# Altium schematic sheet RFD_PWR_MGMT.SchDoc
size C; SheetNumber: 7; SheetTotal: 10
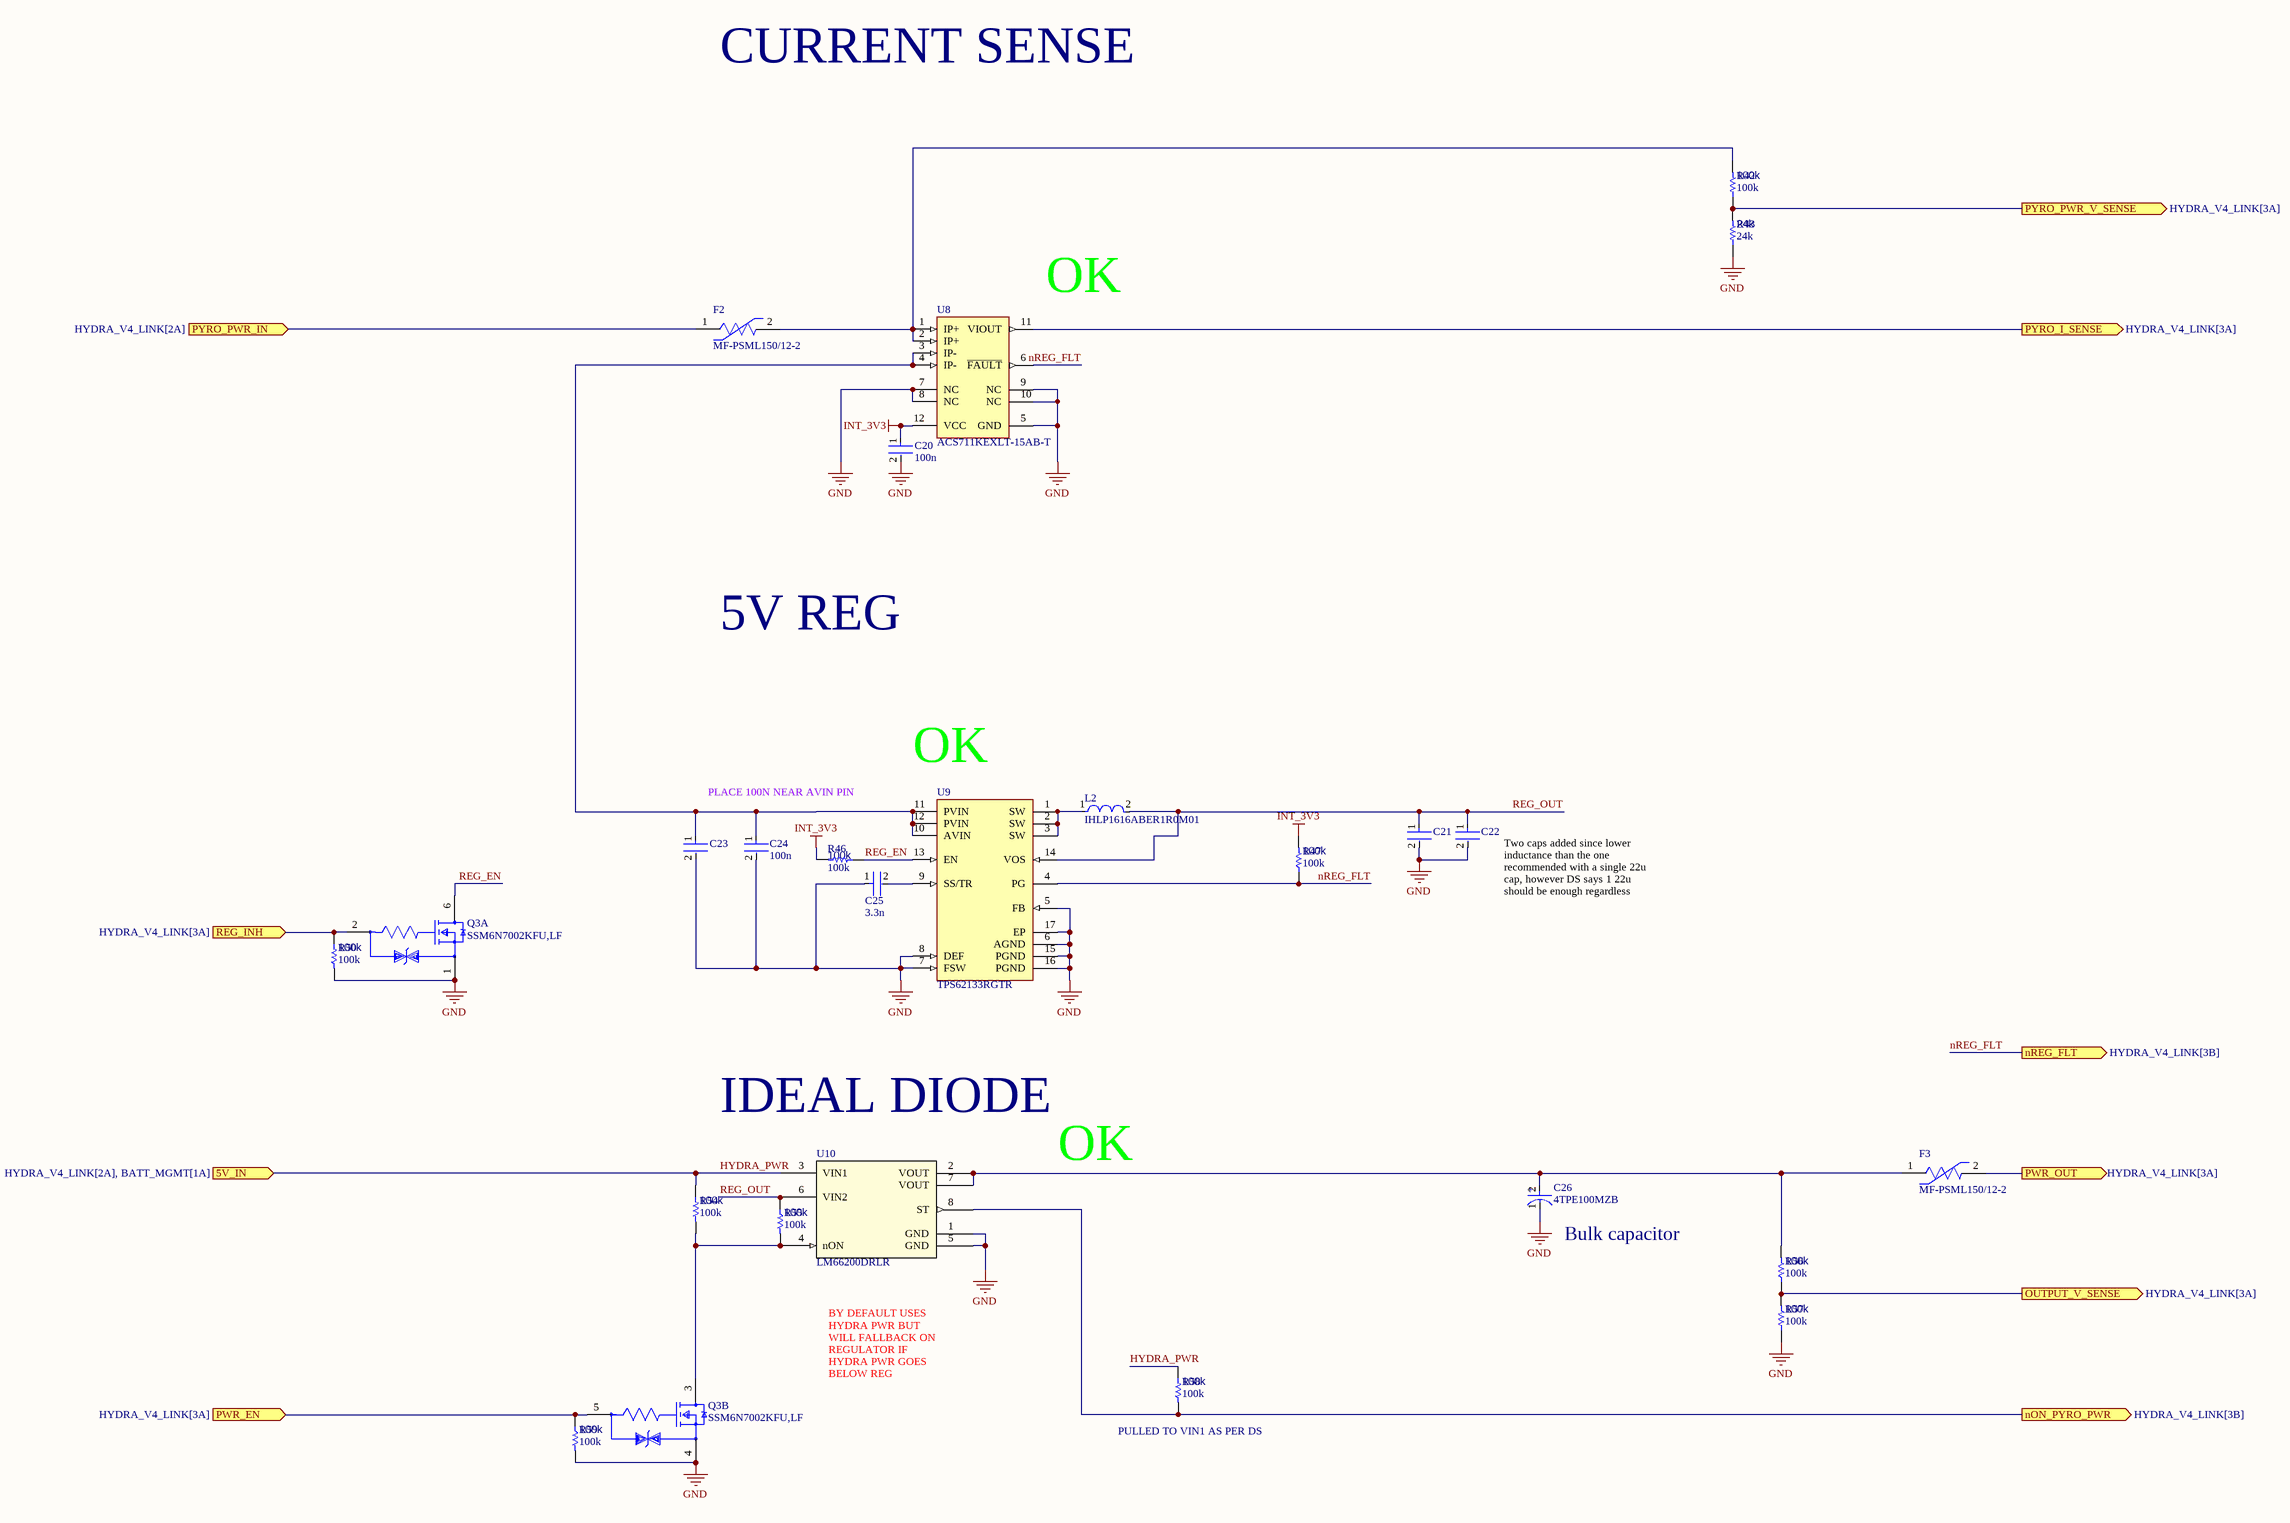
[diagram p0: RFD_PWR_MGMT.SchDoc]

## Parts
C20  100n  [FP-0402-L_1_0_0_05-W_0_5-IPC_A]
C21  GRM21BR61E226ME44L  [FP-GRM21B-0_2-e0_2_0_7-IPC_B]  (value not drawn)
C22  GRM21BR61E226ME44L  [FP-GRM21B-0_2-e0_2_0_7-IPC_B]  (value not drawn)
C23  TMK212BBJ106KG-T  [FP-0805-L_2_0_0_2-W_1_25-MFG]  (value not drawn)
C24  100n  [FP-0402-L_1_0_0_05-W_0_5-IPC_A]
C25  3.3n  [FP-0402-L_1_0_0_05-W_0_5-IPC_A]
C26  4TPE100MZB  [FP-POSCAP-B2-MFG]
F2  MF-PSML150/12-2  [FP-MF-PSMF-MFG]
F3  MF-PSML150/12-2  [FP-MF-PSMF-MFG]
L2  IHLP1616ABER1R0M01  [FP-IHLP-1616AB-FP_1_8545x-MFG]
Q3  SSM6N7002KFU,LF  [FP-SSOP6-P-0_65A-MFG]  (parts A,B of 2)
R42  100k  [R0603B]
R43  24k  [R0603B]
R46  100k  [R0603B]
R47  100k  [R0603B]
R50  100k  [R0603B]
R54  100k  [R0603B]
R55  100k  [R0603B]
R56  100k  [R0603B]
R57  100k  [R0603B]
R58  100k  [R0603B]
R59  100k  [R0603B]
U8  ACS711KEXLT-15AB-T  [ALEG-EX-12_V]
U9  TPS62133RGTR  [RGT0016C_V]
U10  LM66200DRLR  [LM66200DRLR-Footprint-1]

## Ports
5V_IN (in, see HYDRA_V4_LINK[2A], BATT_MGMT[1A]), nON_PYRO_PWR (out, see HYDRA_V4_LINK[3B]), nREG_FLT (out, see HYDRA_V4_LINK[3B]), OUTPUT_V_SENSE (out, see HYDRA_V4_LINK[3A]), PWR_EN (in, see HYDRA_V4_LINK[3A]), PWR_OUT (out, see HYDRA_V4_LINK[3A]), PYRO_I_SENSE (out, see HYDRA_V4_LINK[3A]), PYRO_PWR_IN (in, see HYDRA_V4_LINK[2A]), PYRO_PWR_V_SENSE (out, see HYDRA_V4_LINK[3A]), REG_INH (in, see HYDRA_V4_LINK[3A])

## Nets
GND: C20.2 C21.2 C22.2 C23.2 C24.2 C25.1 C26.1(C) Q3.1(Source1) Q3.4(Source2) R43.1 R50.2 R57.1 R59.2 U8.5(GND) U8.7(NC) U8.8(NC) U8.9(NC) U8.10(NC) U9.5(FB) U9.6(AGND) U9.7(FSW) U9.8(DEF) U9.15(PGND) U9.16(PGND) U9.17(EP) U10.1(GND) U10.5(GND)
INT_3V3: C20.1 R46.2 R47.2 U8.12(VCC)
HYDRA_PWR: R54.1 R58.1 U10.3(VIN1) ; port 5V_IN
nON_PYRO_PWR: R58.2 U10.8(ST) ; port nON_PYRO_PWR
nREG_FLT: R47.1 U8.6(~{FAULT}) U9.4(PG) ; port nREG_FLT
OUTPUT_V_SENSE: R56.1 R57.2 ; port OUTPUT_V_SENSE
PWR_EN: Q3.5(Gate2) R59.1 ; port PWR_EN
PWR_OUT: F3.2 ; port PWR_OUT
PYRO_I_SENSE: U8.11(VIOUT) ; port PYRO_I_SENSE
PYRO_PWR_IN: F2.1 ; port PYRO_PWR_IN
PYRO_PWR_V_SENSE: R42.1 R43.2 ; port PYRO_PWR_V_SENSE
REG_EN: Q3.6(Drain1) R46.1 U9.13(EN)
REG_INH: Q3.2(Gate1) R50.1 ; port REG_INH
REG_OUT: C21.1 C22.1 L2.2 R55.1 U9.14(VOS) U10.6(VIN2)
NetC23_1: C23.1 C24.1 U8.3(IP-) U8.4(IP-) U9.10(AVIN) U9.11(PVIN) U9.12(PVIN)
NetC25_2: C25.2 U9.9(SS/TR)
NetC26_2: C26.2(A) F3.1 R56.2 U10.2(VOUT) U10.7(VOUT)
NetF2_2: F2.2 R42.2 U8.1(IP+) U8.2(IP+)
NetL2_1: L2.1 U9.1(SW) U9.2(SW) U9.3(SW)
NetQ3_3: Q3.3(Drain2) R54.2 R55.2 U10.4(nON)

## Notes on the sheet
- CURRENT SENSE
- (near U8) OK
- 5V REG
- (near U9) OK
- PLACE 100N NEAR AVIN PIN
- (near C22) Two caps added since lower inductance than the one recommended with a single 22u cap, however DS says 1 22u should be enough regardless
- IDEAL DIODE
- OK
- (near C26) Bulk capacitor
- BY DEFAULT USES HYDRA PWR BUT WILL FALLBACK ON REGULATOR IF HYDRA PWR GOES BELOW REG
- (near R58) PULLED TO VIN1 AS PER DS
- (in symbol CMP-05428-001141-1) +

## Library data of the parts
C20 C24 C25 = CMP-001-00058-1: LARGE PADS, 0402 CAP, CHANGE COMMENT TO MATCH REAL P/N; Capacitor Type: Ceramic; Min Operating Temperature: -55°C; Mounting Technology: Surface Mount; Pins: 2; Case/Package: 0402; RoHS Compliant: Yes; Max Operating Temperature: 85°C
  C20 C24: Value: 100n
  C25: Value: 3.3n
C21 C22 = CMP-2007-03222-3: Chip Multilayer Ceramic Capacitors for General Purpose, 0805, 22uF, X5R, 15%, 20%, 25V; Case/Package: 0805; Depth: 1.25mm; Resistor Type: Ceramic; Voltage Rating: 25V; Lead Free: Lead Free; Voltage Rating (DC): 25V; Case Code (Metric): 2012; Thickness: 0.057inch; REACH SVHC: No SVHC; Material: Ceramic; Tolerance: 20%; Length: 2mm; Capacitance: 22uF; Case Code (Imperial): 0805; Max Operating Temperature: 85°C; Termination: SMD/SMT; Weight: 0.000335oz; Dielectric: X5R; Packaging: Tape and Reel; Voltage: 25V; Package Quantity: 3000; Height: 1.25mm; Mount: Surface Mount; Width: 1.25mm; Min Operating Temperature: -55°C; Value: GRM21BR61E226ME44L
C23 = CMP-14477-000079-3: Multilayer Ceramic Capacitor 10uF 25V X5R 10% SMD 0805 T/R; Voltage: 16V; Dielectric: X7R; Number of Pins: 2; Width: 0.049inch; REACH SVHC: No SVHC; Packaging: Tape and Reel; Max Operating Temperature: 85°C; Length: 0.079inch; Termination: SMD/SMT; RoHS Compliant: Yes; Thickness: 0.053inch; Case/Package: 0805; Case Code (Imperial): 0805; Capacitance: 10uF; Lead Free: Lead Free; Voltage Rating: 25V; Resistor Type: Ceramic; Voltage Rating (DC): 25V; Case Code (Metric): 2012; Mount: Surface Mount; Package Quantity: 1; Height: 1.25mm; Series: M; Tolerance: 10%; Min Operating Temperature: -55°C; Value: TMK212BBJ106KG-T
C26 = CMP-05428-001141-1: Molded Tantalum Polymer Capacitor 100uF 20% 4V life 1000Hours SMD 1411; Leakage Current: 40uA; Polarity: Polar; Dissipation Factor: 8%; ESR (Equivalent Series Resistance): 35mR; Ripple Current: 1.4A; Capacitance: 100uF; Voltage: 4V; Voltage Rating (DC): 4V; Package Quantity: 2000; Packaging: Tape and Reel; RoHS Compliant: Yes; Voltage Rating: 4V; Case Code (Imperial): 1210; Construction: Flat; Max Operating Temperature: 105°C; Termination: SMD/SMT; Case Code (Metric): 3528; Case/Package: Molded; Tolerance: 20%; Min Operating Temperature: -55°C; Lead Free: Lead Free; Features: General Purpose; Height: 1.9mm; Length: 3.5mm; Series: POSCAP™ TPE; Number of Pins: 2; Height - Seated (Max): 0.079inch; Mount: Surface Mount; Width: 2.8mm; REACH SVHC: No SVHC; Radiation Hardening: No; Depth: 2.8mm; Value: 4TPE100MZB
F2 F3 = CMP-07400-000013-1: Manufacturer Part Number: MF-PSMF050X-2; Manufacturer: Bourns Inc.; Trip Current: 1A; Trip Time: 0.1s; Value: 0.15-0.9Ω; Hold Current: 0.5A; Current Rating: 40A; Voltage Rating: 6V; Category: Fuse; Temperature: -40°C to +85°C; ComponentLink2Description: Datasheet; Temperature Range High: +85°C; Package: MF-PSMF; Device Class L1: Circuit Protection; Lead Free: Yes; ComponentLink2URL: https://www.bourns.com/docs/product-datasheets/mfpsmf.pdf?sfvrsn=9c05cafe_24; Ambient Temperature Range Low: -40°C; Mouser Description: Resettable Fuses - PPTC .50A 6V 0.15ohm Hold .5 Trip 1; Resistance: 0.15-0.9Ω; Automotive: Yes; Ambient Temperature Range High: +85°C; Device Class L2: PTC Resettable Fuses; Temperature Range Low: -40°C; Device Class L3: unset; Octopart: https://octopart.com/mf-psmf050x-2-bourns-7483438; Digikey Description: PTC RESET FUSE 6V 500MA 0805; Height: 0.85mm; RoHS: TRUE
L2 = CMP-02424-000161-1: Fixed Inductors Commercial High Saturation Series SMT 1uH 4A 52.5mΩ 20%; Test Frequency: 100kHz; Max DC Current: 8.5A; Shielding: Shielded; Core Material: Metal; Self Resonant Frequency: 64MHz; Saturation Current: 7A; DC Resistance (DCR): 52.5mR; Radiation Hardening: No; Height - Seated (Max): 0.047inch; Case Code (Imperial): 1616; Case Code (Metric): 4040; Width: 0.16inch; Case/Package: 1616; Depth: 4.31mm; Height: 1.2mm; Inductance Tolerance: 20%; Lead Free: Lead Free; Termination: SMD/SMT; Military Standard: Not; RMS Current (Irms): 4A; Inductance: 1uH; Length: 4.7mm; Package Quantity: 4000; Number of Pins: 1616; Max Operating Temperature: 125°C; Contact Plating: Tin; Tolerance: 20%; Packaging: Tape and Reel; Current Rating: 4A; Min Operating Temperature: -55°C; Mount: Surface Mount
Q3 = CMP-006-0005-1: Transistor MOSFET Array Dual N-CH 60V 300mA 6-Pin SOT-363 Emboss T/R; Max Power Dissipation: 285mW; Input Capacitance: 40pF; FET Type: 2 N-Channel; Rds On Max: 1.5R; Mounting Technology: Surface Mount; Continuous Drain Current (ID): 300mA; Drain to Source Voltage (Vdss): 60V; Packaging: Cut Tape; Series: -
R42 R43 R46 R47 R50 R54-R59 = CMP-009-00002-14: Resistor
  R42 R46 R47 R50 R54-R59: Value: 100k
  R43: Value: 24k
U8 = CMP-1557-00001-1: Hall Effect Linear Current Sensor with Overcurrent Fault Output for <100 V Isolation Applications, 3 to 5.5 V, -15.5 to 15.5 A IP, -40 to 125 degC, 12-Pin QFN (EX), RoHS, Tape and Reel; VCC Max: 5.5 V; IP Max: 15.5 A; VCC Min: 3 V; IP Min: -15.5 A; -3dB Bandwidth: 0.1 MHz; PackageDescription: 12-Pin Quad Flat No-Lead, Body 3 x 3 mm, Height 0.8 mm; ComponentLink1URL: http://www.allegromicro.com/; Packing: Tape and Reel; ComponentLink2URL: http://www.allegromicro.com/~/media/Files/Datasheets/ACS711-Datasheet.ashx?la=en; DatasheetVersion: Rev. 3; PartNumber: ACS711KEXLT-15AB-T; ComponentLink2Description: Datasheet; ComponentLink3URL: http://www.allegromicro.com/~/media/Files/Datasheets/ACS711-Datasheet.ashx?la=en; RoHS: TRUE; ComponentLink1Description: Manufacturer URL; ComponentLink3Description: Package Specification; Temperature Max: 125 degC; Mounting Technology: Surface Mount; Temperature Min: -40 degC
U9 = CMP-0323-00146-3: Buck Step Down Regulator with 3 to 17 V Input and 5 V Output, -40 to 85 degC, 16-Pin QFN (RGT), Green (RoHS & no Sb/Br); Manufacturer: Texas Instruments; Preset Vout(V): 5; Regulated Outputs(#): 1; Synchronous Rectification: TRUE; Duty Cycle(Max)(%): 100; Vin(Min)(V): 3; Vin(Max)(V): 17; Rating: Catalog; SubFamily: Step-Down Regulator; Switch Current Limit(Typ)(A): 4.2; Iq(Typ)(mA): 0.017; ComponentLink1Description: Datasheet; PackageVersion: revH, Oct-2011; ComponentLink2URL: http://www.ti.com/litv/pdf/mpqf119g; Code_JEDEC: MO-220; ComponentLink2Description: Package Specification; Vout(Max)(V): 5; ComponentLink3URL: Samples URL:http://www.ti.com/product/tps62133#samples; PackageReference: RGT0016C; ComponentLink3Description: URL Link1; Mounting Technology: Surface Mount; DatasheetVersion: SLVSAG7; PartNumber: TPS62133RGTR; Iout(Max)(A): 3; Eco-Plan: Green (RoHS & no Sb/Br); PackageDescription: 16-Pin Plastic Quad Flat No-Lead, 3 x 3 mm Body, 0.5 mm Pitch, 1.7 x 1.7 mm Exposed Pad; Topology: Buck; Vout(Min)(V): 5; ComponentLink1URL: http://www.ti.com/general/docs/lit/getliterature.tsp?genericPartNumber=TPS62133&fileType=pdf
U10 = CMP-019-00049-1: 1.6-V to 5.5-V, 40-mΩ, 2.5-A, low-IQ, dual ideal diode 8-SOT-5X3 -40 to 125